# Altium schematic sheet P[07]_CPU_PHY.SchDoc
size 386 x 246 mm
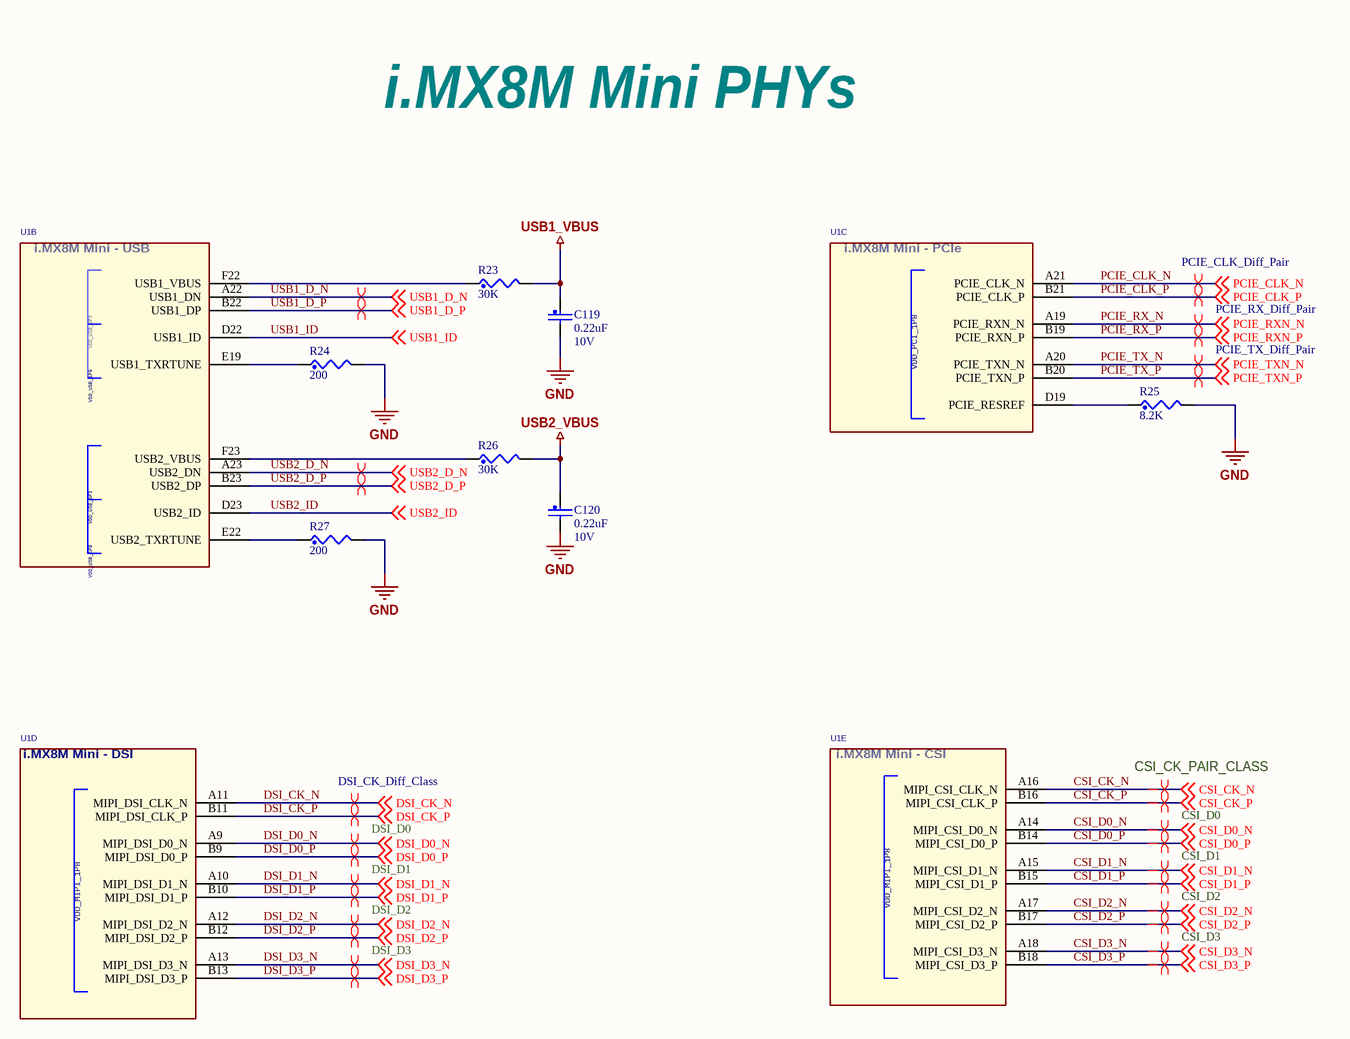
[diagram p0: P[07]_CPU_PHY.SchDoc]

## Parts
C119  0.22uF  Voltage: 10V  [0201_CC - C]
C120  0.22uF  Voltage: 10V  [0201_CC - C]
R23  30K  [0201_CC]
R24  200  [0201_CC]
R25  8.2K  [0402_CC]
R26  30K  [0201_CC]
R27  200  [0201_CC]
U1  (no value)  [BGA486_0P5_14X14]  (parts B,C,D,E of 14)

## Nets
GND: C119.2 C120.2 R24.2 R25.2 R27.2
USB1_VBUS: C119.1 R23.2
USB2_VBUS: C120.1 R26.2
CSI_CK_N: U1.A16(MIPI_CSI_CLK_N) ; off-sheet CSI_CK_N
CSI_CK_P: U1.B16(MIPI_CSI_CLK_P) ; off-sheet CSI_CK_P
CSI_D0_N: U1.A14(MIPI_CSI_D0_N) ; off-sheet CSI_D0_N
CSI_D0_P: U1.B14(MIPI_CSI_D0_P) ; off-sheet CSI_D0_P
CSI_D1_N: U1.A15(MIPI_CSI_D1_N) ; off-sheet CSI_D1_N
CSI_D1_P: U1.B15(MIPI_CSI_D1_P) ; off-sheet CSI_D1_P
CSI_D2_N: U1.A17(MIPI_CSI_D2_N) ; off-sheet CSI_D2_N
CSI_D2_P: U1.B17(MIPI_CSI_D2_P) ; off-sheet CSI_D2_P
CSI_D3_N: U1.A18(MIPI_CSI_D3_N) ; off-sheet CSI_D3_N
CSI_D3_P: U1.B18(MIPI_CSI_D3_P) ; off-sheet CSI_D3_P
DSI_CK_N: U1.A11(MIPI_DSI_CLK_N) ; off-sheet DSI_CK_N
DSI_CK_P: U1.B11(MIPI_DSI_CLK_P) ; off-sheet DSI_CK_P
DSI_D0_N: U1.A9(MIPI_DSI_D0_N) ; off-sheet DSI_D0_N
DSI_D0_P: U1.B9(MIPI_DSI_D0_P) ; off-sheet DSI_D0_P
DSI_D1_N: U1.A10(MIPI_DSI_D1_N) ; off-sheet DSI_D1_N
DSI_D1_P: U1.B10(MIPI_DSI_D1_P) ; off-sheet DSI_D1_P
DSI_D2_N: U1.A12(MIPI_DSI_D2_N) ; off-sheet DSI_D2_N
DSI_D2_P: U1.B12(MIPI_DSI_D2_P) ; off-sheet DSI_D2_P
DSI_D3_N: U1.A13(MIPI_DSI_D3_N) ; off-sheet DSI_D3_N
DSI_D3_P: U1.B13(MIPI_DSI_D3_P) ; off-sheet DSI_D3_P
PCIE_CLK_N: U1.A21(PCIE_CLK_N) ; off-sheet PCIE_CLK_N
PCIE_CLK_P: U1.B21(PCIE_CLK_P) ; off-sheet PCIE_CLK_P
PCIE_RX_N: U1.A19(PCIE_RXN_N) ; off-sheet PCIE_RXN_N  [also labelled PCIE_RXN_N]
PCIE_RX_P: U1.B19(PCIE_RXN_P) ; off-sheet PCIE_RXN_P  [also labelled PCIE_RXN_P]
PCIE_TX_N: U1.A20(PCIE_TXN_N) ; off-sheet PCIE_TXN_N  [also labelled PCIE_TXN_N]
PCIE_TX_P: U1.B20(PCIE_TXN_P) ; off-sheet PCIE_TXN_P  [also labelled PCIE_TXN_P]
USB1_D_N: U1.A22(USB1_DN) ; off-sheet USB1_D_N
USB1_D_P: U1.B22(USB1_DP) ; off-sheet USB1_D_P
USB1_ID: U1.D22(USB1_ID) ; off-sheet USB1_ID
USB2_D_N: U1.A23(USB2_DN) ; off-sheet USB2_D_N
USB2_D_P: U1.B23(USB2_DP) ; off-sheet USB2_D_P
USB2_ID: U1.D23(USB2_ID) ; off-sheet USB2_ID
NetR23_1: R23.1 U1.F22(USB1_VBUS)
NetR24_1: R24.1 U1.E19(USB1_TXRTUNE)
NetR25_1: R25.1 U1.D19(PCIE_RESREF)
NetR26_1: R26.1 U1.F23(USB2_VBUS)
NetR27_1: R27.1 U1.E22(USB2_TXRTUNE)

## Layout directives
differential pair: CSI_CK_P, CSI_D0_P, CSI_D1_P, CSI_D2_P, CSI_D3_P, DSI_CK_P, DSI_D0_P, DSI_D1_P, DSI_D2_P, DSI_D3_P, PCIE_CLK_P, PCIE_RX_P, PCIE_TX_P, USB1_D_N, USB1_D_P, USB2_D_N, USB2_D_P
differential pair; differential pair class DSI_CK_Diff_Class: DSI_CK_N
differential pair; differential pair class DSI_D0: DSI_D0_N
differential pair; differential pair class DSI_D1: DSI_D1_N
differential pair; differential pair class DSI_D2: DSI_D2_N
differential pair; differential pair class DSI_D3: DSI_D3_N
differential pair; net class PCIE_TX_Diff_Pair: PCIE_TX_N
differential pair; differential pair class PCIE_RX_Diff_Pair: PCIE_RX_N
differential pair; differential pair class PCIE_CLK_Diff_Pair: PCIE_CLK_N
differential pair; differential pair class CSI_CK_PAIR_CLASS: CSI_CK_N
differential pair; differential pair class CSI_D0: CSI_D0_N
differential pair; differential pair class CSI_D1: CSI_D1_N
differential pair; differential pair class CSI_D2: CSI_D2_N
differential pair; differential pair class CSI_D3: CSI_D3_N

## Notes on the sheet
- i.MX8M Mini PHYs
- (in symbol MIMX8MM_BGA486P, part B) i.MX8M Mini - USB
- (in symbol MIMX8MM_BGA486P, part C) i.MX8M Mini - PCIe
- (in symbol MIMX8MM_BGA486P, part D) i.MX8M Mini - DSI
- (in symbol MIMX8MM_BGA486P, part E) i.MX8M Mini - CSI

## Library data of the parts
C119 C120 = CAP_NP: CLASS: DISCRETE
R23-R27 = RES: CLASS: DISCRETE
U1 = MIMX8MM_BGA486P: IC CPU QUAD CORTEX A53+M4 1.8GHZ BGA486 / By Arman Arvand; SPLIT_INST: TRUE; CAD_APPROVED: Yes; PRE_APN: 330-77072; MFG_PN01: MIMX8MM6DVTLZAA; MFG_NAME01: NXP SEMICONDUCTORS; AGILE_PN: TMP-WF-32905; CLASS: IC; HEIGHT: 1.25MM; ROHS: Yes